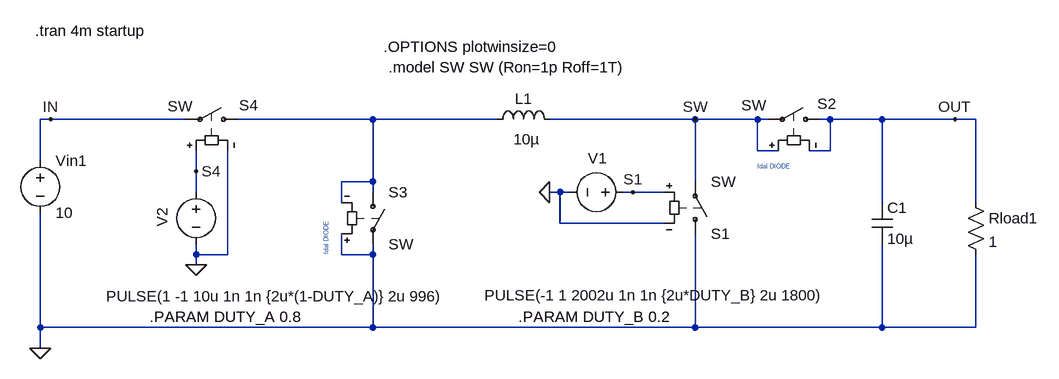
[diagram p0: schematic Fig_7-36_H-Bridge_Ideal.asc]
Fig_7-36_H-Bridge_Ideal.asc, the LTspice schematic file:
Version 4
SHEET 1 880 680
WIRE -1504 -448 -1520 -448
WIRE -1296 -448 -1504 -448
WIRE -1008 -448 -1216 -448
WIRE -816 -448 -1008 -448
WIRE -512 -448 -736 -448
WIRE -416 -448 -512 -448
WIRE -400 -448 -416 -448
WIRE -304 -448 -320 -448
WIRE -224 -448 -304 -448
WIRE -112 -448 -224 -448
WIRE -80 -448 -112 -448
WIRE -416 -400 -416 -448
WIRE -384 -400 -416 -400
WIRE -304 -400 -304 -448
WIRE -304 -400 -336 -400
WIRE -1520 -384 -1520 -448
WIRE -1280 -368 -1280 -400
WIRE -1008 -352 -1008 -448
WIRE -1008 -352 -1056 -352
WIRE -512 -352 -512 -448
WIRE -1280 -336 -1280 -368
WIRE -1008 -336 -1008 -352
WIRE -720 -336 -736 -336
WIRE -704 -336 -720 -336
WIRE -608 -336 -624 -336
WIRE -560 -336 -608 -336
WIRE -1056 -320 -1056 -352
WIRE -224 -320 -224 -448
WIRE -80 -320 -80 -448
WIRE -720 -288 -720 -336
WIRE -560 -288 -720 -288
WIRE -1280 -240 -1280 -256
WIRE -1232 -240 -1232 -400
WIRE -1232 -240 -1280 -240
WIRE -1056 -240 -1056 -272
WIRE -1008 -240 -1008 -256
WIRE -1008 -240 -1056 -240
WIRE -1280 -224 -1280 -240
WIRE -1520 -128 -1520 -304
WIRE -1008 -128 -1008 -240
WIRE -1008 -128 -1520 -128
WIRE -512 -128 -512 -272
WIRE -512 -128 -1008 -128
WIRE -224 -128 -224 -256
WIRE -224 -128 -512 -128
WIRE -80 -128 -80 -240
WIRE -80 -128 -224 -128
WIRE -1520 -96 -1520 -128
FLAG -1520 -96 0
FLAG -112 -448 OUT
FLAG -1504 -448 IN
FLAG -512 -448 SW
FLAG -736 -336 0
FLAG -1280 -224 0
FLAG -1280 -368 S4
FLAG -608 -336 S1
SYMBOL sw -512 -256 M180
SYMATTR InstName S1
SYMBOL ind -832 -432 R270
WINDOW 0 32 56 VTop 2
WINDOW 3 1 61 VBottom 2
SYMATTR InstName L1
SYMATTR Value 10µ
SYMBOL cap -240 -320 R0
SYMATTR InstName C1
SYMATTR Value 10µ
SYMBOL voltage -1520 -400 R0
WINDOW 123 0 0 Left 2
WINDOW 39 0 0 Left 2
SYMATTR InstName Vin1
SYMATTR Value 10
SYMBOL voltage -608 -336 M270
WINDOW 123 0 0 Left 2
WINDOW 39 0 0 Left 2
WINDOW 0 52 40 VRight 2
WINDOW 3 -159 -298 VRight 2
SYMATTR InstName V1
SYMATTR Value PULSE(-1 1 2002u 1n 1n {2u*DUTY_B} 2u 1800)
SYMBOL res -96 -336 R0
SYMATTR InstName Rload1
SYMATTR Value 1
SYMBOL sw -304 -448 M270
WINDOW 0 24 20 VLeft 2
WINDOW 3 22 137 VLeft 2
SYMATTR InstName S2
SYMBOL sw -1008 -352 R0
SYMATTR InstName S3
SYMBOL sw -1200 -448 M270
WINDOW 0 22 14 VLeft 2
WINDOW 3 20 124 VLeft 2
SYMATTR InstName S4
SYMBOL voltage -1280 -352 M0
WINDOW 123 0 0 Left 2
WINDOW 39 0 0 Left 2
WINDOW 0 52 40 VRight 2
WINDOW 3 -386 176 Left 2
SYMATTR InstName V2
SYMATTR Value PULSE(1 -1 10u 1n 1n {2u*(1-DUTY_A)} 2u 996)
TEXT -984 -528 Left 2 !.model SW SW (Ron=1p Roff=1T)
TEXT -1528 -584 Left 2 !.tran 4m startup
TEXT -416 -376 Left 0 ;Idal DIODE
TEXT -992 -560 Left 2 !.OPTIONS plotwinsize=0
TEXT -1080 -240 VLeft 0 ;Idal DIODE
TEXT -1352 -144 Left 2 !.PARAM DUTY_A 0.8
TEXT -784 -144 Left 2 !.PARAM DUTY_B 0.2

The netlist it stands for:
* Fig_7-36_H-Bridge_Ideal.asc
S1 0 SW S1 0 SW
L1 N001 SW 10µ
C1 OUT 0 10µ
Vin1 IN 0 10
V1 S1 0 PULSE(-1 1 2002u 1n 1n {2u*DUTY_B} 2u 1800)
Rload1 OUT 0 1
S2 OUT SW SW OUT SW
S3 N001 0 0 N001 SW
S4 N001 IN S4 0 SW
V2 S4 0 PULSE(1 -1 10u 1n 1n {2u*(1-DUTY_A)} 2u 996)
.model SW SW (Ron=1p Roff=1T)
.tran 4m startup
* Idal DIODE
.OPTIONS plotwinsize=0
* Idal DIODE
.PARAM DUTY_A 0.8
.PARAM DUTY_B 0.2
.backanno
.end